# Altium schematic sheet lcd_breakout.SchDoc
size Letter
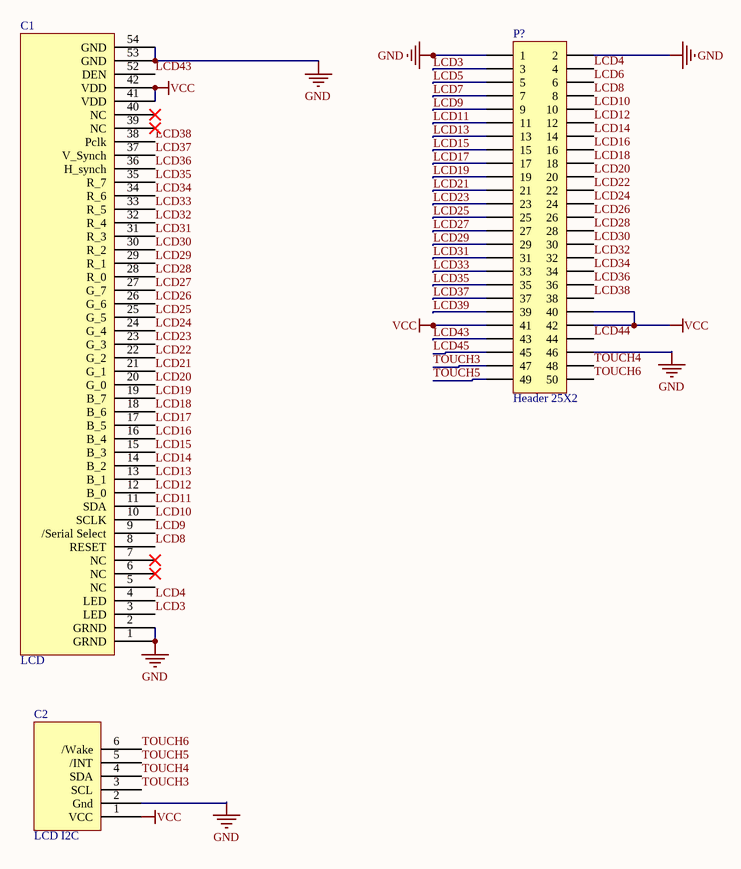
[diagram p0: lcd_breakout.SchDoc]

## Parts
C1  LCD  [Molex54 - duplicate2]
C2  LCD I2C  [Molex6]
P?  Header 25X2  [HDR2X25]

## Nets
GND: C1.1(GRND) C1.2(GRND) C1.53(GND) C1.54(GND) C2.2(Gnd) P?.1 P?.2 P?.46
VCC: C1.41(VDD) C1.42(VDD) C2.1(VCC) P?.40 P?.41 P?.42
LCD3: C1.3(LED) P?.3
LCD4: C1.4(LED) P?.4
LCD5: P?.5
LCD6: P?.6
LCD7: P?.7
LCD8: C1.8(RESET) P?.8
LCD9: C1.9(/Serial_Select) P?.9
LCD10: C1.10(SCLK) P?.10
LCD11: C1.11(SDA) P?.11
LCD12: C1.12(B_0) P?.12
LCD13: C1.13(B_1) P?.13
LCD14: C1.14(B_2) P?.14
LCD15: C1.15(B_3) P?.15
LCD16: C1.16(B_4) P?.16
LCD17: C1.17(B_5) P?.17
LCD18: C1.18(B_6) P?.18
LCD19: C1.19(B_7) P?.19
LCD20: C1.20(G_0) P?.20
LCD21: C1.21(G_1) P?.21
LCD22: C1.22(G_2) P?.22
LCD23: C1.23(G_3) P?.23
LCD24: C1.24(G_4) P?.24
LCD25: C1.25(G_5) P?.25
LCD26: C1.26(G_6) P?.26
LCD27: C1.27(G_7) P?.27
LCD28: C1.28(R_0) P?.28
LCD29: C1.29(R_1) P?.29
LCD30: C1.30(R_2) P?.30
LCD31: C1.31(R_3) P?.31
LCD32: C1.32(R_4) P?.32
LCD33: C1.33(R_5) P?.33
LCD34: C1.34(R_6) P?.34
LCD35: C1.35(R_7) P?.35
LCD36: C1.36(H_synch) P?.36
LCD37: C1.37(V_Synch) P?.37
LCD38: C1.38(Pclk) P?.38
LCD39: P?.39
LCD43: C1.52(DEN) P?.43
LCD44: P?.44
LCD45: P?.45
TOUCH3: C2.3(SCL) P?.47
TOUCH4: C2.4(SDA) P?.48
TOUCH5: C2.5(/INT) P?.49
TOUCH6: C2.6(/Wake) P?.50

Not connected (* = marked no-connect by the designer): C1 5(NC) 6(NC)* 7(NC)* 39(NC)* 40(NC)*

## Library data of the parts
C1 = LCD: pin to pad: 1>A1 2>A2 3>A3 4>A4 5>A5 6>A6 7>A7 8>A8 9>A9 10>A10 11>A11 12>A12 13>A13 14>A14 15>A15 16>A16 17>A17 18>A18 19>A19 20>A20 21>A21 22>A22 23>A23 24>A24 25>A25 26>A26 27>A27 28>A28 29>A29 30>A30 31>A31 32>A32 33>A33 34>A34 35>A35 36>A36 37>A37 38>A38 39>A39 40>A40 41>A41 42>A42 52>A52 53>A53 54>A54
P? = Header 25X2: Header, 25-Pin, Dual row; LatestRevisionDate: 17-Jul-2002; LatestRevisionNote: Re-released for DXP Platform.; Publisher: Altium Limited